# EAGLE design 164.001.01B-v2 (EAGLE 7.2.0)
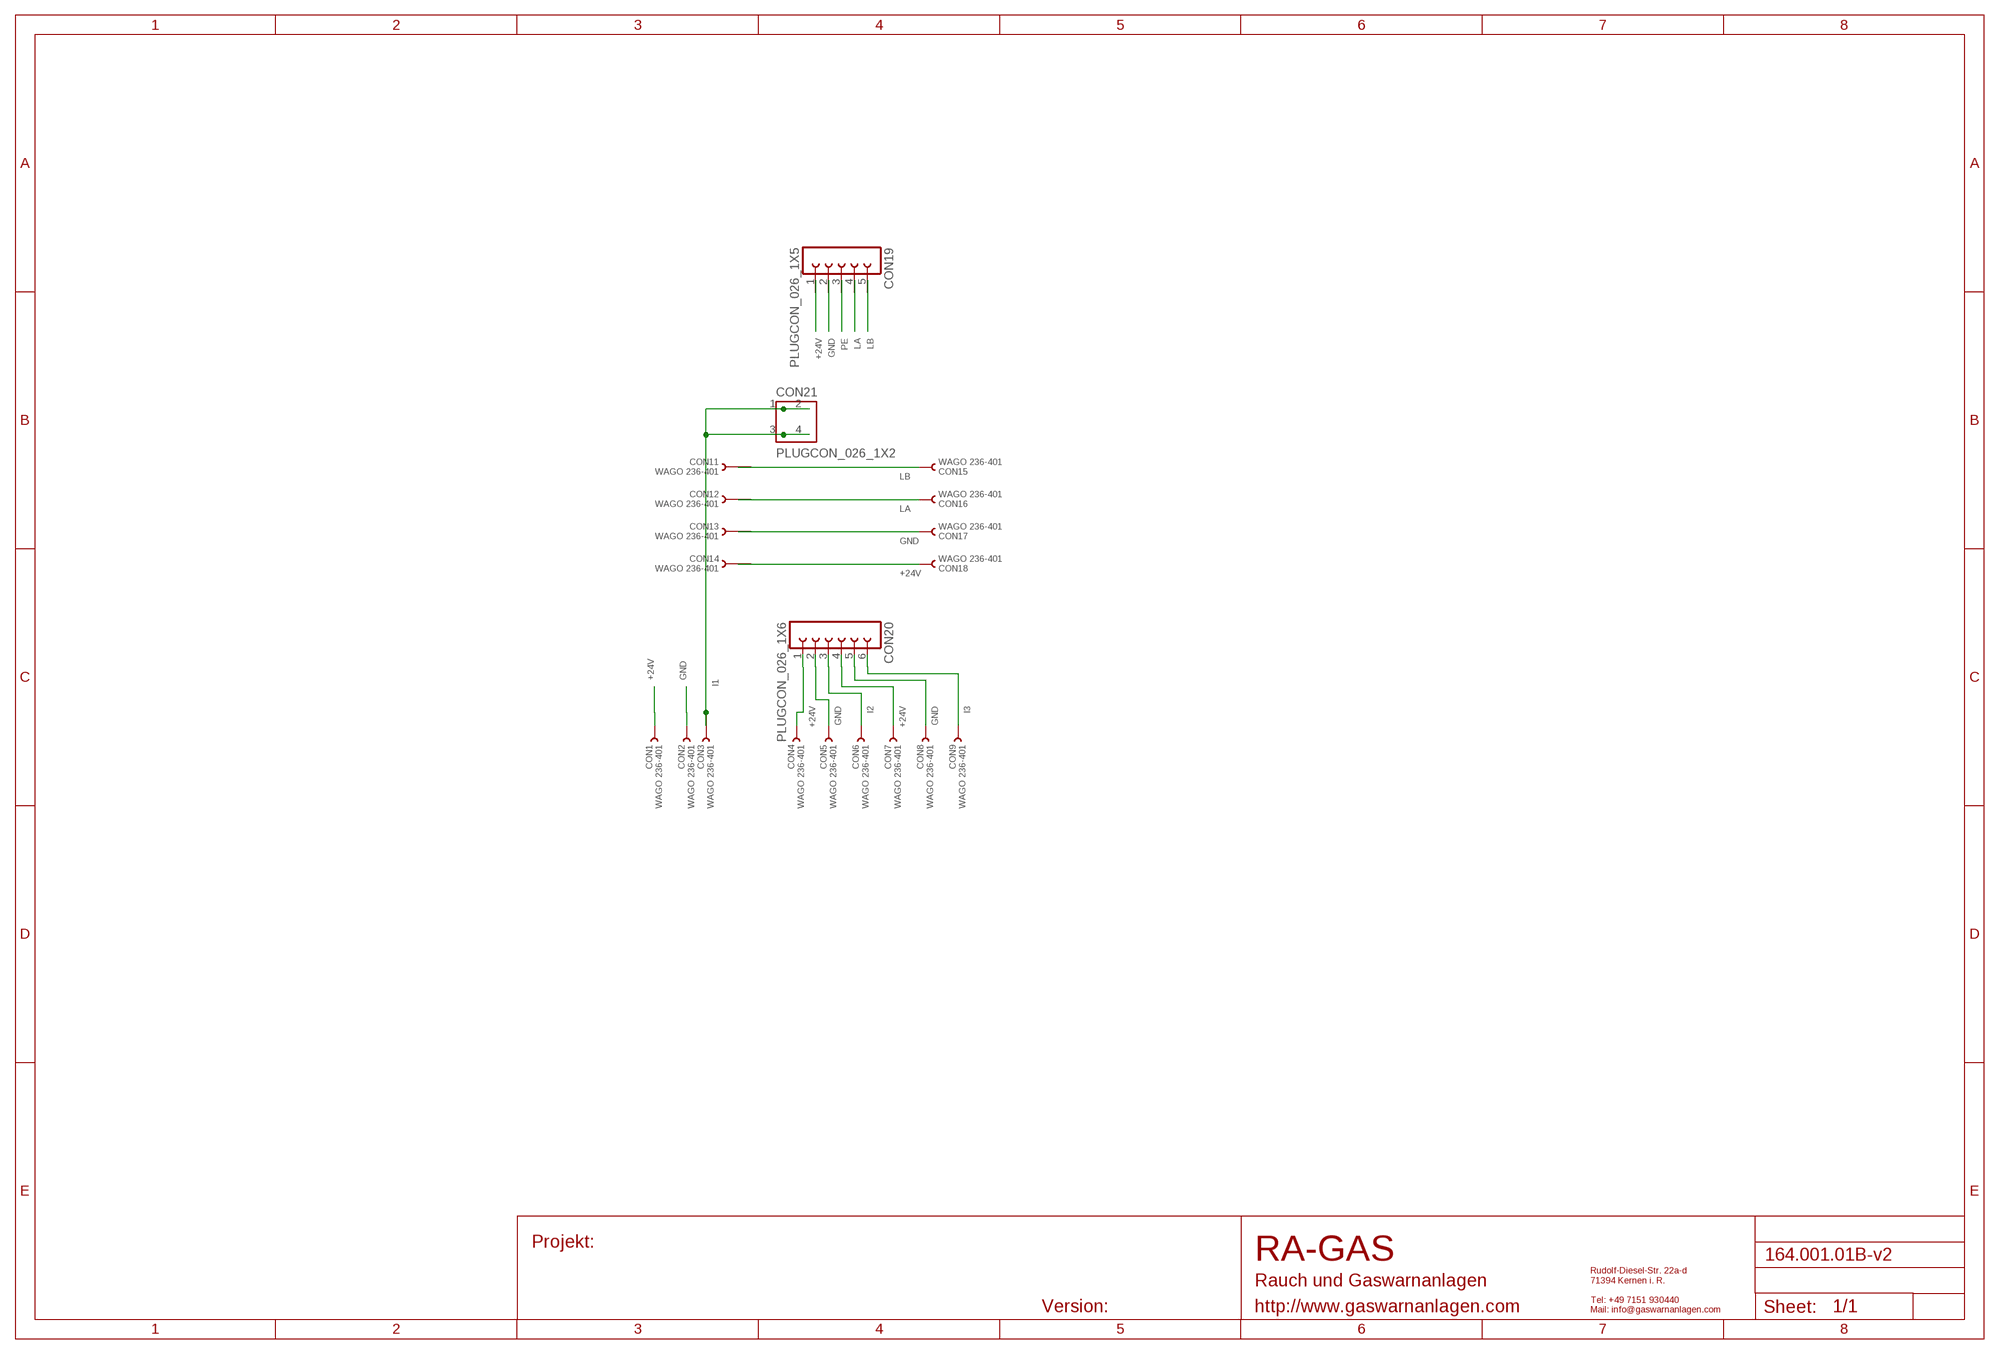
[diagram p0: schematic, sheet 1]

## Parts
CON1  WAGO 236-401  RK1_WAGO236  [WAGO236]
CON2  WAGO 236-401  RK1_WAGO236  [WAGO236]
CON3  WAGO 236-401  RK1_WAGO236  [WAGO236]
CON4  WAGO 236-401  RK1_WAGO236  [WAGO236]
CON5  WAGO 236-401  RK1_WAGO236  [WAGO236]
CON6  WAGO 236-401  RK1_WAGO236  [WAGO236]
CON7  WAGO 236-401  RK1_WAGO236  [WAGO236]
CON8  WAGO 236-401  RK1_WAGO236  [WAGO236]
CON9  WAGO 236-401  RK1_WAGO236  [WAGO236]
CON11  WAGO 236-401  RK1_WAGO236  [WAGO236]
CON12  WAGO 236-401  RK1_WAGO236  [WAGO236]
CON13  WAGO 236-401  RK1_WAGO236  [WAGO236]
CON14  WAGO 236-401  RK1_WAGO236  [WAGO236]
CON15  WAGO 236-401  RK1_WAGO236  [WAGO236]
CON16  WAGO 236-401  RK1_WAGO236  [WAGO236]
CON17  WAGO 236-401  RK1_WAGO236  [WAGO236]
CON18  WAGO 236-401  RK1_WAGO236  [WAGO236]
CON19  PLUGCON_026_1X5  [PLUGCON1X5]
CON20  PLUGCON_026_1X6  [PLUGCON1X6]
CON21  PLUGCON_026_1X2  [PLUGCON1X2]

## Nets
+24V: CON1.1 CON1.2 CON4.1 CON4.2 CON7.1 CON7.2 CON14.1 CON14.2 CON18.1 CON18.2 CON19.1 CON19.6 CON20.1 CON20.4 CON20.7 CON20.10
GND: CON2.1 CON2.2 CON5.1 CON5.2 CON8.1 CON8.2 CON13.1 CON13.2 CON17.1 CON17.2 CON19.2 CON19.7 CON20.2 CON20.5 CON20.8 CON20.11
I1: CON3.1 CON3.2 CON21.1 CON21.2 CON21.3 CON21.4
I2: CON6.1 CON6.2 CON20.3 CON20.9
I3: CON9.1 CON9.2 CON20.6 CON20.12
LA: CON12.1 CON12.2 CON16.1 CON16.2 CON19.4 CON19.9
LB: CON11.1 CON11.2 CON15.1 CON15.2 CON19.5 CON19.10
PE: CON19.3 CON19.8

## Library data of the parts
CON1-CON9 CON11-CON18 = MHSCon:RK1_WAGO236: Wago 236 Reihenklemme
CON19 = MHSCon:PLUGCON_026_1X5
CON20 = MHSCon:PLUGCON_026_1X6
CON21 = con-ria-metz:PLUGCON_026_1X2

## Board
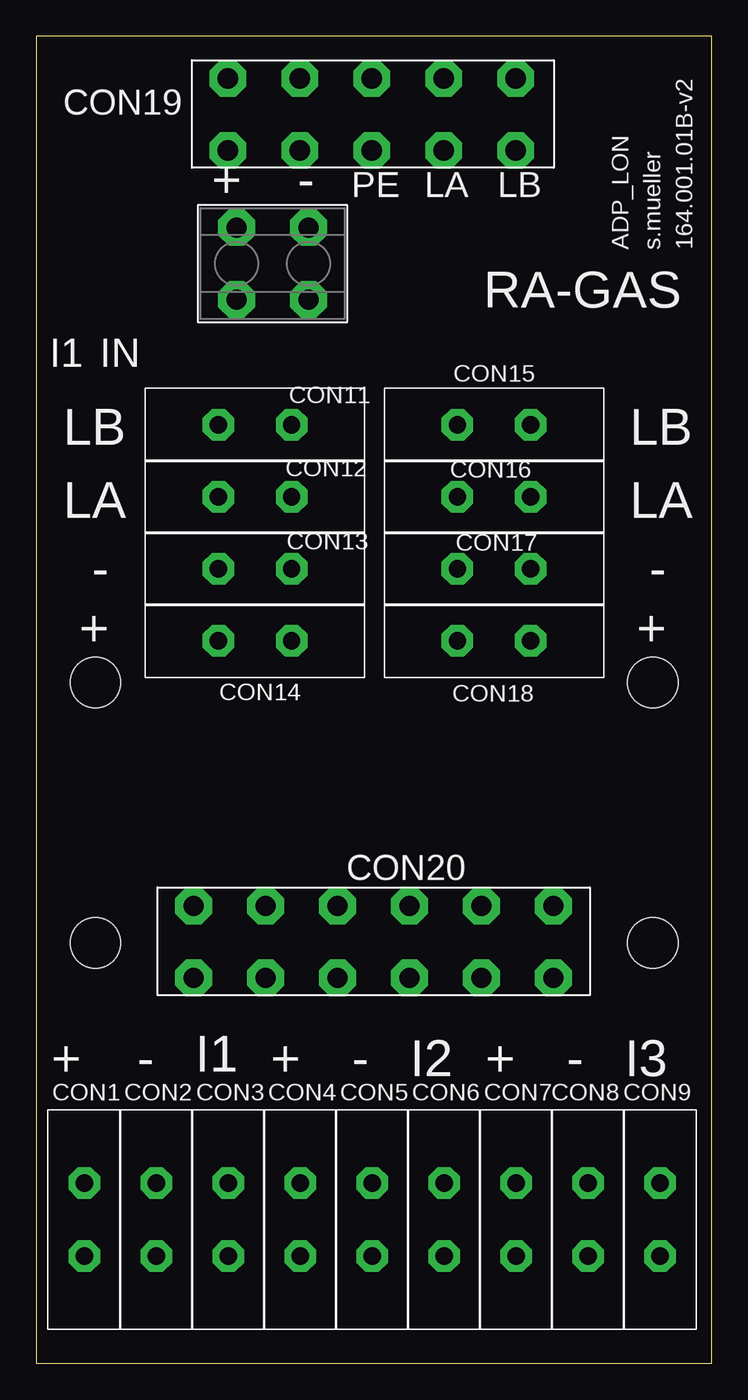
[diagram p1: board, top side]
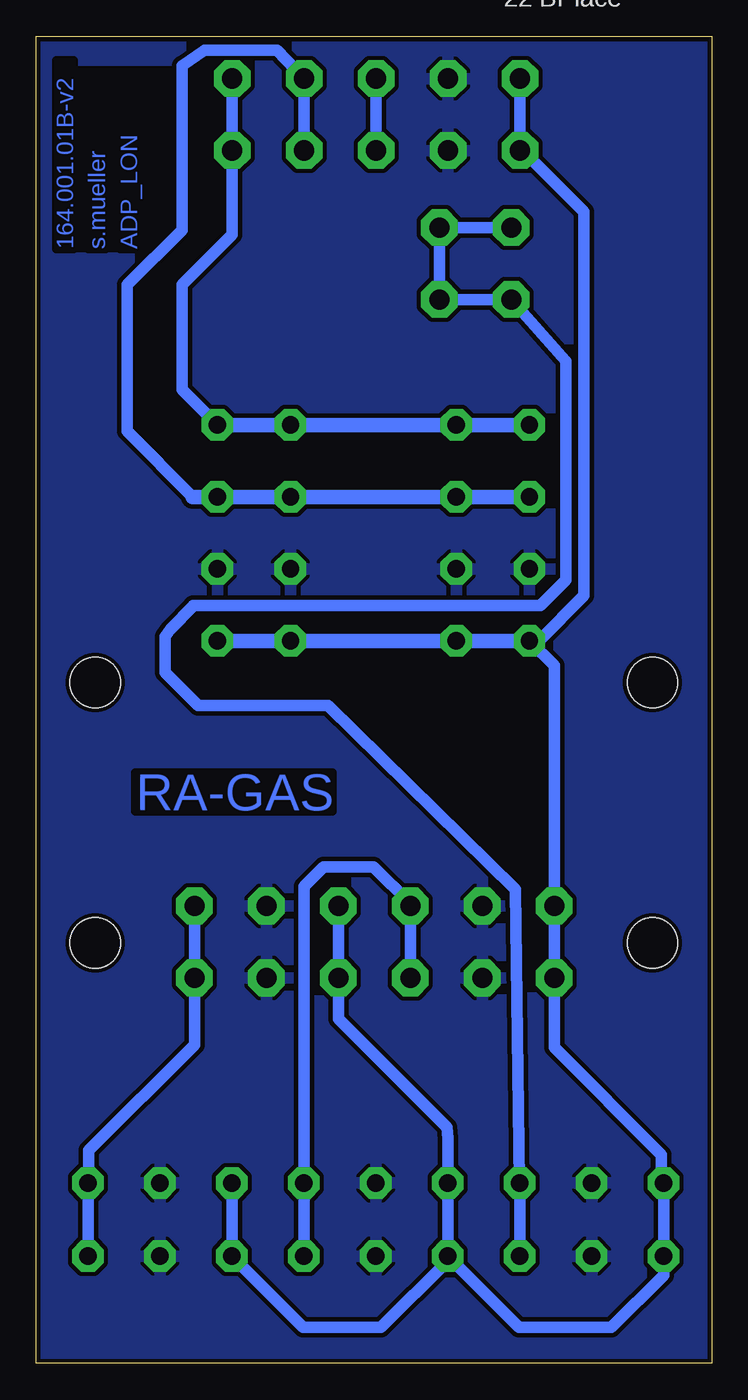
[diagram p2: board, bottom side, seen from below]

Size 46.97 x 92.22 mm. Coordinates in mm from the lower left corner, seen from the top.
Outline: 0,0 46.97,0 46.97,92.22 0,92.22 0,0
Copper layers (1*16): Top 0.035mm / dielectric 1.5mm / Bottom 0.035mm
Design rules "SparkFun": minimum track width 8mil, minimum drill 20mil, track to track 8mil, track to pad 8mil, pad to pad 8mil, via to via 8mil, smd to smd 8mil, copper to edge 8mil, drill to drill 8mil, minimum pad ring 12mil, minimum via ring 10mil, stop-mask expansion 4mil, vias tented up to drill 20mil, thermal gap 10mil
Holes 3.5 mm at 4.13,29.21 42.86,29.21 4.13,47.31 42.86,47.31
bRestrict: area 38.1,78.1 to 44.5,89.9; area 26.4,38.4 to 40.1,41.1

### Footprints (pad centres in the part's own frame; a part is rotated, then mirrored left to right if it is on the bottom)
WAGO236 = drill 1.2 pad 2.184 octagon: 1 -2.54,0; 2 2.54,0
PLUGCON1X5 = drill 1.4 pad 2.54 octagon: 1 -10,2.45; 2 -5,2.45; 3 0,2.45; 4 5,2.45; 5 10,2.45; 6 -10,-2.55; 7 -5,-2.55; 8 0,-2.55; 9 5,-2.55; 10 10,-2.55
PLUGCON1X6 = drill 1.4 pad 2.54 octagon: 1 -12.5,2.44; 2 -7.5,2.44; 3 -2.5,2.44; 4 2.5,2.44; 5 7.5,2.44; 6 12.5,2.44; 7 -12.5,-2.56; 8 -7.5,-2.56; 9 -2.5,-2.56; 10 2.5,-2.56; 11 7.5,-2.56; 12 12.5,-2.56
PLUGCON1X2 = drill 1.4 pad 2.54 octagon: 1 -2.5,2.5; 2 2.5,2.5; 3 -2.5,-2.5; 4 2.5,-2.5

### Placement (x,y rotation side)
CON1  3.36,10 270 top
CON2  8.36,10 270 top
CON3  13.36,10 270 top
CON4  18.36,10 270 top
CON5  23.36,10 270 top
CON6  28.36,10 270 top
CON7  33.36,10 270 top
CON8  38.36,10 270 top
CON9  43.36,10 270 top
CON11  15.22,65.21 0 top
CON12  15.22,60.21 0 top
CON13  15.22,55.21 0 top
CON14  15.22,50.21 0 top
CON15  31.82,65.21 0 top
CON16  31.82,60.21 0 top
CON17  31.82,55.21 0 top
CON18  31.82,50.21 0 top
CON19  23.34,86.82 0 top
CON20  23.45,29.35 0 top
CON21  16.44,76.41 180 top
U$1  [TITLE]  3.49,94.25 0 top

### Tracks (layer width: path | path; a pad name or v marks a point on that pad's centre or on a via)
+24V
  Bottom 0.254: CON19.6 13.34,84.17 13.04,84.17
  Bottom 0.813: CON19.1 CON19.6 | 13.04,84.17 8.89,80.01 8.89,53.34 12.02,50.21 CON14.1 10.95,48.48 CON20.1 CON20.7 10.95,21.95 3.5,14.5 3.5,12.68 CON1.1 CON1.2 3.36,6.14 7,2.5 13.4,2.5 CON4.2 | CON7.1 CON7.2 28.4,2.5 23,2.5 18.36,7.14 CON4.2 | CON4.2 CON4.1 18.36,15.64 18.4,16.4 25.95,23.95 CON20.10 CON20.4
  Bottom 1.016: CON14.1 CON14.2 CON18.1 CON18.2
GND
  pour Bottom (isolate 0.3): 0,91.44 0,0 46.99,0 46.99,91.44
I1
  Bottom 0.254: CON3.1 13.36,12.38 13.37,12.59
  Bottom 0.813: CON3.2 13.36,12.38 | CON21.4 CON21.3 CON21.1 CON21.2 10.16,69.63 10.16,54.42 11.93,52.65 36,52.65 | 36,52.65 36.06,52.65 | 13.37,12.59 13.67,32.92 26.67,45.72 35.72,45.72 38,48 38,50.5 37.65,51 36,52.65
I2
  Bottom 0.254: CON20.3 20.95,31.95
  Bottom 0.813: CON6.2 CON6.1 28.36,33.14 27,34.5 23.5,34.5 20.95,31.95 | CON20.3 CON20.9
I3
  Bottom 0.813: CON20.6 CON20.12 35.95,22.15 43.3,14.8 43.3,12.6 CON9.1 CON9.2
LA
  Bottom 0.254: CON16.1 CON16.2
  Bottom 0.813: 36.08,60.21 40.64,64.77 40.64,74.93 36.83,78.74 36.83,90.17 35.26,91.24 30.21,91.24 CON19.4 CON19.9
  Bottom 1.016: CON12.1 CON12.2 CON16.1 36.08,60.21
LB
  Bottom 0.254: 28.79,65.21 29,65 | 29,65 29.08,65 CON15.1 | 29.21,65.21 29,65
  Bottom 0.813: CON19.5 CON19.10 33.34,78.42 36.83,74.93 36.83,67.67 CON15.2
  Bottom 1.016: 28.79,65.21 CON11.2 CON11.1 | CON15.2 29.21,65.21
PE
  Bottom 0.813: CON19.3 CON19.8

### Text on the board
Bottom: ADP_LON | RA-GAS
tPlace: + | - | PE | LA | LB | ADP_LON | RA-GAS | I1 | IN | LB | LB | LA | LA | - | - | + | + | + | - | I1 | + | - | I2 | + | - | I3